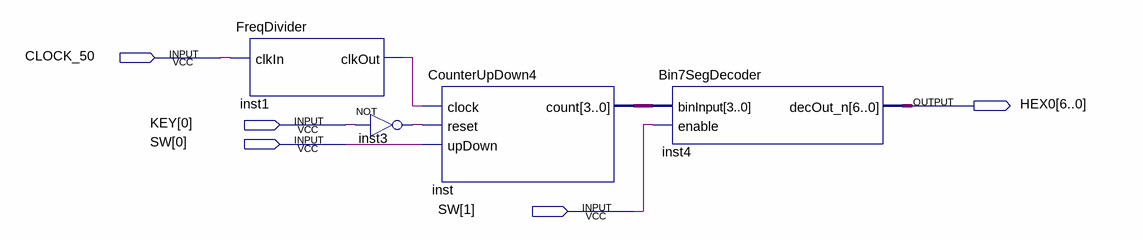
[diagram p0: schematic sheet]
// Quartus schematic CounterDemo.bdf as structural Verilog: 4 symbols, 5 pins
module CounterDemo (
  input  CLOCK_50,
  input  [0:0] KEY,
  input  [1:0] SW,
  output [6:0] HEX0
);

  wire inst1_clkout, inst3_out;
  wire [3:0] inst_count;

  FreqDivider inst1 (.clkIn(CLOCK_50), .clkOut(inst1_clkout));
  not inst3 (inst3_out, KEY[0]);
  CounterUpDown4 inst (.clock(inst1_clkout), .reset(inst3_out), .upDown(SW[0]), .count(inst_count));
  Bin7SegDecoder inst4 (.binInput(inst_count), .enable(SW[1]), .decOut_n(HEX0));
endmodule
